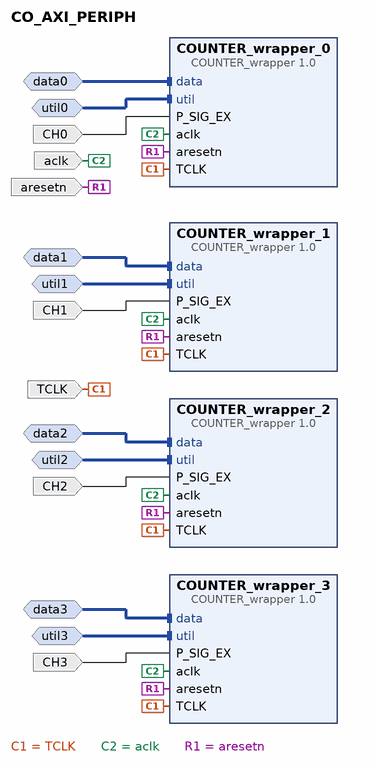
[diagram p0: block diagram of the top level]
# Vivado block design CO_AXI_PERIPH, xc7z020clg400-1, Vivado 2019.1
create_bd_design CO_AXI_PERIPH

create_bd_intf_port -mode Slave -vlnv xilinx.com:interface:aximm_tlm:1.0 data0
create_bd_intf_port -mode Slave -vlnv xilinx.com:interface:aximm_tlm:1.0 data1
set_property -dict {CONFIG.MAX_BURST_LENGTH 1} [get_bd_intf_ports data1]
create_bd_intf_port -mode Slave -vlnv xilinx.com:interface:aximm_tlm:1.0 data2
create_bd_intf_port -mode Slave -vlnv xilinx.com:interface:aximm_tlm:1.0 data3
create_bd_intf_port -mode Slave -vlnv xilinx.com:interface:aximm_tlm:1.0 util0
create_bd_intf_port -mode Slave -vlnv xilinx.com:interface:aximm_tlm:1.0 util1
set_property -dict {CONFIG.MAX_BURST_LENGTH 1} [get_bd_intf_ports util1]
create_bd_intf_port -mode Slave -vlnv xilinx.com:interface:aximm_tlm:1.0 util2
create_bd_intf_port -mode Slave -vlnv xilinx.com:interface:aximm_tlm:1.0 util3
create_bd_port -dir I TCLK
create_bd_port -dir I aclk
create_bd_port -dir I aresetn
create_bd_port -dir I CH0
create_bd_port -dir I CH1
create_bd_port -dir I CH2
create_bd_port -dir I CH3

create_bd_cell -type ip -vlnv cri.nz:user:COUNTER_wrapper:1.0 COUNTER_wrapper_0
create_bd_cell -type ip -vlnv cri.nz:user:COUNTER_wrapper:1.0 COUNTER_wrapper_1
create_bd_cell -type ip -vlnv cri.nz:user:COUNTER_wrapper:1.0 COUNTER_wrapper_2
create_bd_cell -type ip -vlnv cri.nz:user:COUNTER_wrapper:1.0 COUNTER_wrapper_3

# ---- connections ----

connect_bd_intf_net -intf_net data2_1 [get_bd_intf_ports data2] [get_bd_intf_pins COUNTER_wrapper_2/data]
connect_bd_intf_net -intf_net data0_1 [get_bd_intf_ports data0] [get_bd_intf_pins COUNTER_wrapper_0/data]
connect_bd_intf_net -intf_net data3_1 [get_bd_intf_ports data3] [get_bd_intf_pins COUNTER_wrapper_3/data]
connect_bd_intf_net -intf_net data1_1 [get_bd_intf_ports data1] [get_bd_intf_pins COUNTER_wrapper_1/data]
connect_bd_intf_net -intf_net util2_1 [get_bd_intf_ports util2] [get_bd_intf_pins COUNTER_wrapper_2/util]
connect_bd_intf_net -intf_net util0_1 [get_bd_intf_ports util0] [get_bd_intf_pins COUNTER_wrapper_0/util]
connect_bd_intf_net -intf_net util3_1 [get_bd_intf_ports util3] [get_bd_intf_pins COUNTER_wrapper_3/util]
connect_bd_intf_net -intf_net util1_1 [get_bd_intf_ports util1] [get_bd_intf_pins COUNTER_wrapper_1/util]
connect_bd_net [get_bd_ports TCLK] \
  [get_bd_pins COUNTER_wrapper_0/TCLK] [get_bd_pins COUNTER_wrapper_1/TCLK] [get_bd_pins COUNTER_wrapper_2/TCLK] \
  [get_bd_pins COUNTER_wrapper_3/TCLK]
connect_bd_net -net CH0_1 [get_bd_ports CH0] [get_bd_pins COUNTER_wrapper_0/P_SIG_EX]
connect_bd_net [get_bd_ports aclk] \
  [get_bd_pins COUNTER_wrapper_0/aclk] [get_bd_pins COUNTER_wrapper_1/aclk] [get_bd_pins COUNTER_wrapper_2/aclk] \
  [get_bd_pins COUNTER_wrapper_3/aclk]
connect_bd_net [get_bd_ports aresetn] \
  [get_bd_pins COUNTER_wrapper_0/aresetn] [get_bd_pins COUNTER_wrapper_1/aresetn] [get_bd_pins COUNTER_wrapper_2/aresetn] \
  [get_bd_pins COUNTER_wrapper_3/aresetn]
connect_bd_net -net CH1_1 [get_bd_ports CH1] [get_bd_pins COUNTER_wrapper_1/P_SIG_EX]
connect_bd_net -net CH2_1 [get_bd_ports CH2] [get_bd_pins COUNTER_wrapper_2/P_SIG_EX]
connect_bd_net -net CH3_1 [get_bd_ports CH3] [get_bd_pins COUNTER_wrapper_3/P_SIG_EX]

validate_bd_design
save_bd_design
